# Altium schematic sheet BIO26_sensor_connect.SchDoc
size A4
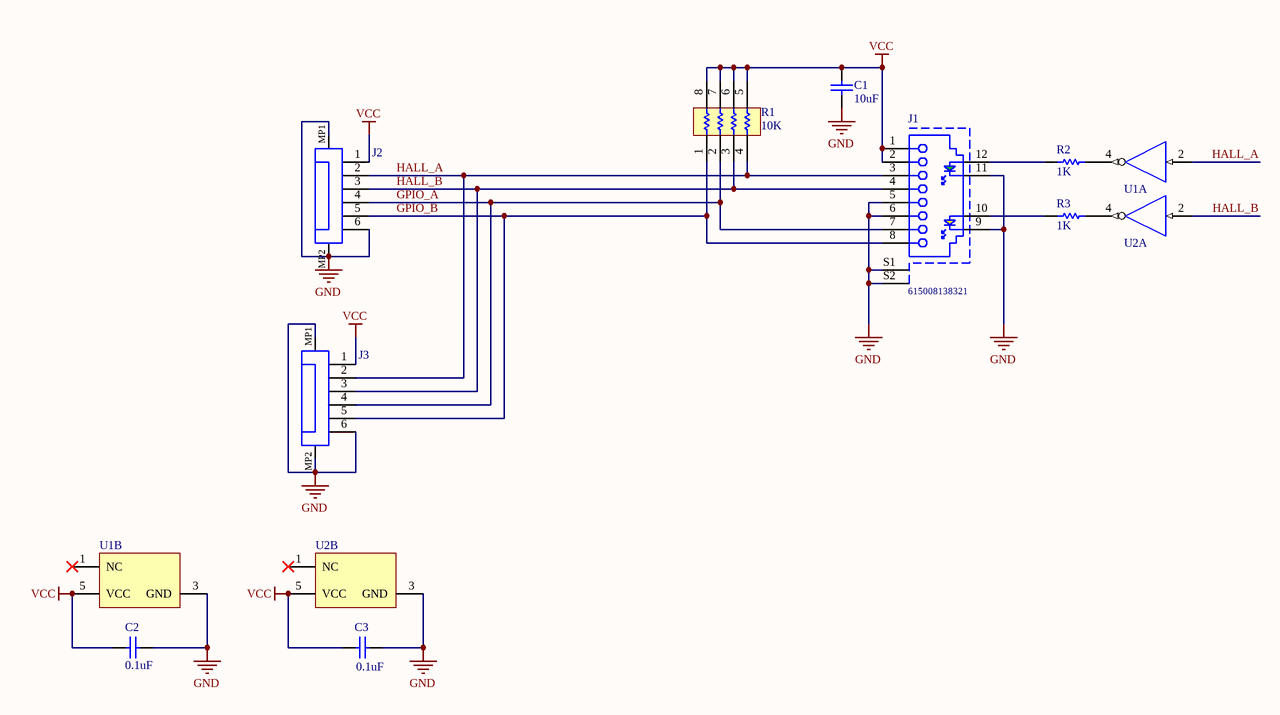
[diagram p0: BIO26_sensor_connect.SchDoc]

## Parts
C1  10uF  [CAPC2013X140X50LL20T25]
C2  0.1uF  [CAPC1608X87X35NL15T15]
C3  0.1uF  [CAPC1608X87X35NL15T15]
J1  615008138321  [615008138321]
J2  68610614422  [68610614422]  (value not drawn)
J3  68610614422  [68610614422]  (value not drawn)
R1  10K  [BOUR-CAY16-J4_V]
R2  1K  [RESC1608X55X30ML15T15]
R3  1K  [RESC1608X55X30ML15T15]
U1  SN74AHC1G14DBVR  [DBV0005A_L]  (value not drawn)  (parts A,B of 2)
U2  SN74AHC1G14DBVR  [DBV0005A_L]  (value not drawn)  (parts A,B of 2)

## Nets
GND: C1.1 C2.2 C3.2 J1.5 J1.6 J1.9 J1.11 J1.S1 J1.S2 J2.6 J2.MP1 J2.MP2 J3.6 J3.MP1 J3.MP2 U1.3(GND) U2.3(GND)
VCC: C1.2 C2.1 C3.1 J1.1 J1.2 J2.1 J3.1 R1.5 R1.6 R1.7 R1.8 U1.5(VCC) U2.5(VCC)
GPIO_A: J1.7 J2.4 J3.4 R1.2
GPIO_B: J1.8 J2.5 J3.5 R1.1
HALL_A: J1.3 J2.2 J3.2 R1.4 U1.2(A)
HALL_B: J1.4 J2.3 J3.3 R1.3 U2.2(A)
NetJ1_10: J1.10 R3.2
NetJ1_12: J1.12 R2.2
NetR2_1: R2.1 U1.4(Y)
NetR3_1: R3.1 U2.4(Y)

Not connected (* = marked no-connect by the designer): U1 1(NC)*; U2 1(NC)*

## Library data of the parts
C1 = CMP-2007-03243-1: Part Number: C0805C106K8PACTU; Manufacturer: Kemet
C2 C3 = CMP-2006-03300-1: Part Number: C0603X104K5RACTU; Manufacturer: Kemet
J1 = CMP-1502-01732-1: Modular Jack WR-MJ, Shielded, with LED, Vertical Entry, THT, 8P8C; Manufacturer: Wurth Elektronik; Contact Resistance: 20mOhm; Rated Current: 1.5A; Compliance: Leadfree/RoHS; Withstanding Voltage: 1000VAC; Working Voltage: 120VAC; Port: 1x1; System: Connector; Datasheet URL: https://katalog.we-online.com/em/datasheet/615008138321%284%29.pdf; Entrance: Vertical; Operating Temperature: -40to85degC; Part Number: 615008138321; Mounting Technology: THT; Package Reference: 615008138321; Pin Number: 8P8C; Publisher: WurthElektronik; Manufacturer URL: http://www.we-online.de; Packaging: Tray
J2 J3 = CMP-1502-01454-1: SMT ZIF Connectors WR-FPC, Horizontal, Bottom Contact, pitch 1 mm, 6 pins; Manufacturer: Wurth Elektronik; Contact Resistance: 20mOhm; Rated Current: 1A; Pitch: 1mm; Withstanding Voltage: 500VAC; Working Voltage: 125VAC; Pin Number: 6; Operating Temperature: -25to85degC; Packaging: TapeandReel; Contact Design: BottomContact; Manufacturer URL: http://www.we-online.de; Part Number: 68610614422; Publisher: WurthElektronik; Package Reference: 68610614422; Datasheet URL: https://katalog.we-online.de/em/datasheet/68610614422.pdf; Mounting Technology: SMT; Orientation: Horizontal; System: Connector
R1 = CMP-1747-00005-1: Chip Resistor Array, 10 KOhm, +/- 5%, 62.5 mW, -55 to 125 degC, 8-Pin SMD, RoHS, Tape and Reel; Power Rating: 100 mW; Case\Package: 0603; Voltage Rating: 75 V; Tolerance: 1%; Resistance: 220 Ohm; Packaging: Tape and Reel; Min Operating Temperature: -55 degC; Pins: 2; Radiation Hardening: No; DatasheetVersion: Jan-15; Length: 0.063 inch; RoHSCompliant: true; Mount: Surface Mount; ComponentLink1Description: Manufacturer URL; ComponentLink1URL: http://www.bourns.com/; Weight: 7.1E-05 oz; ComponentLink2URL: http://www.bourns.com/docs/Product-Datasheets/CATCAY.pdf; PackageReference: CAY16-J4; Width: 0.031 inch; Case Code (Imperial): 0603; Case Code (Metric): 1608; REACH SVHC: Yes; Max Operating Temperature: 155 degC; ComponentLink2Description: Datasheet; Height: 0.022 inch; PackageDescription: 8-Pin Surface Mount Device, Body 1.6 x 3.2 mm, Pitch 0.8 mm
R2 R3 = CMP-2000-00703-1: Part Number: ERJ-3GEYJ102V; Manufacturer: Panasonic
U1 U2 = CMP-2000-07131-1: Single Schmitt-Trigger Inverter Gate, 10.6 ns max, 2 to 5.5 V, -40 to 125 degC, 5-Pin SOT23 (DBV), Green (RoHS & no Sb/Br), Tape and Reel; Manufacturer: Texas Instruments; Supply Voltage Min: 2V; Logic IC Function: SingleInverterwithSchmittTrigger; No. of Pins: 5; Logic IC Family: AHC; Output Current: 8mA; Supply Voltage: 5.5V; Logic Function Number: 741G14; SVHC: NoSVHC(19-Dec-2012); No. of Gates: 1; Base Number: 74; Supply Voltage Range: 2Vto5.5V; Logic IC Base Number: 74114; Logic Case Style: SOT-23; Datasheet Version: Rev. Q, 09/2015; Mounting Technology: SurfaceMount; Termination Type: SMD; Operating Temperature Max: 85°C; IC Generic Number: 74AHC1G14; Operating Temperature Min: -40°C; No. of Inputs: 1; Supply Voltage Max: 5.5V; Datasheet URL: http://www.ti.com/lit/ds/symlink/sn74ahc1g14.pdf; Package Description: 5-Pin Small Outline Transistor, Body 2.9 x 1.6 mm, Pitch 0.95 mm; Operating Temperature Range: -40°Cto+85°C; Output Current Max: 8mA; Package URL: http://www.ti.com/lit/ml/mpds018l/mpds018l.pdf; Package Reference: DBV0005A; Logic Type: Inverter; Manufacturer URL: http://www.ti.com/; Package / Case: SOT-23